# EAGLE design Noduino-iBaihe (EAGLE 6.6.0)
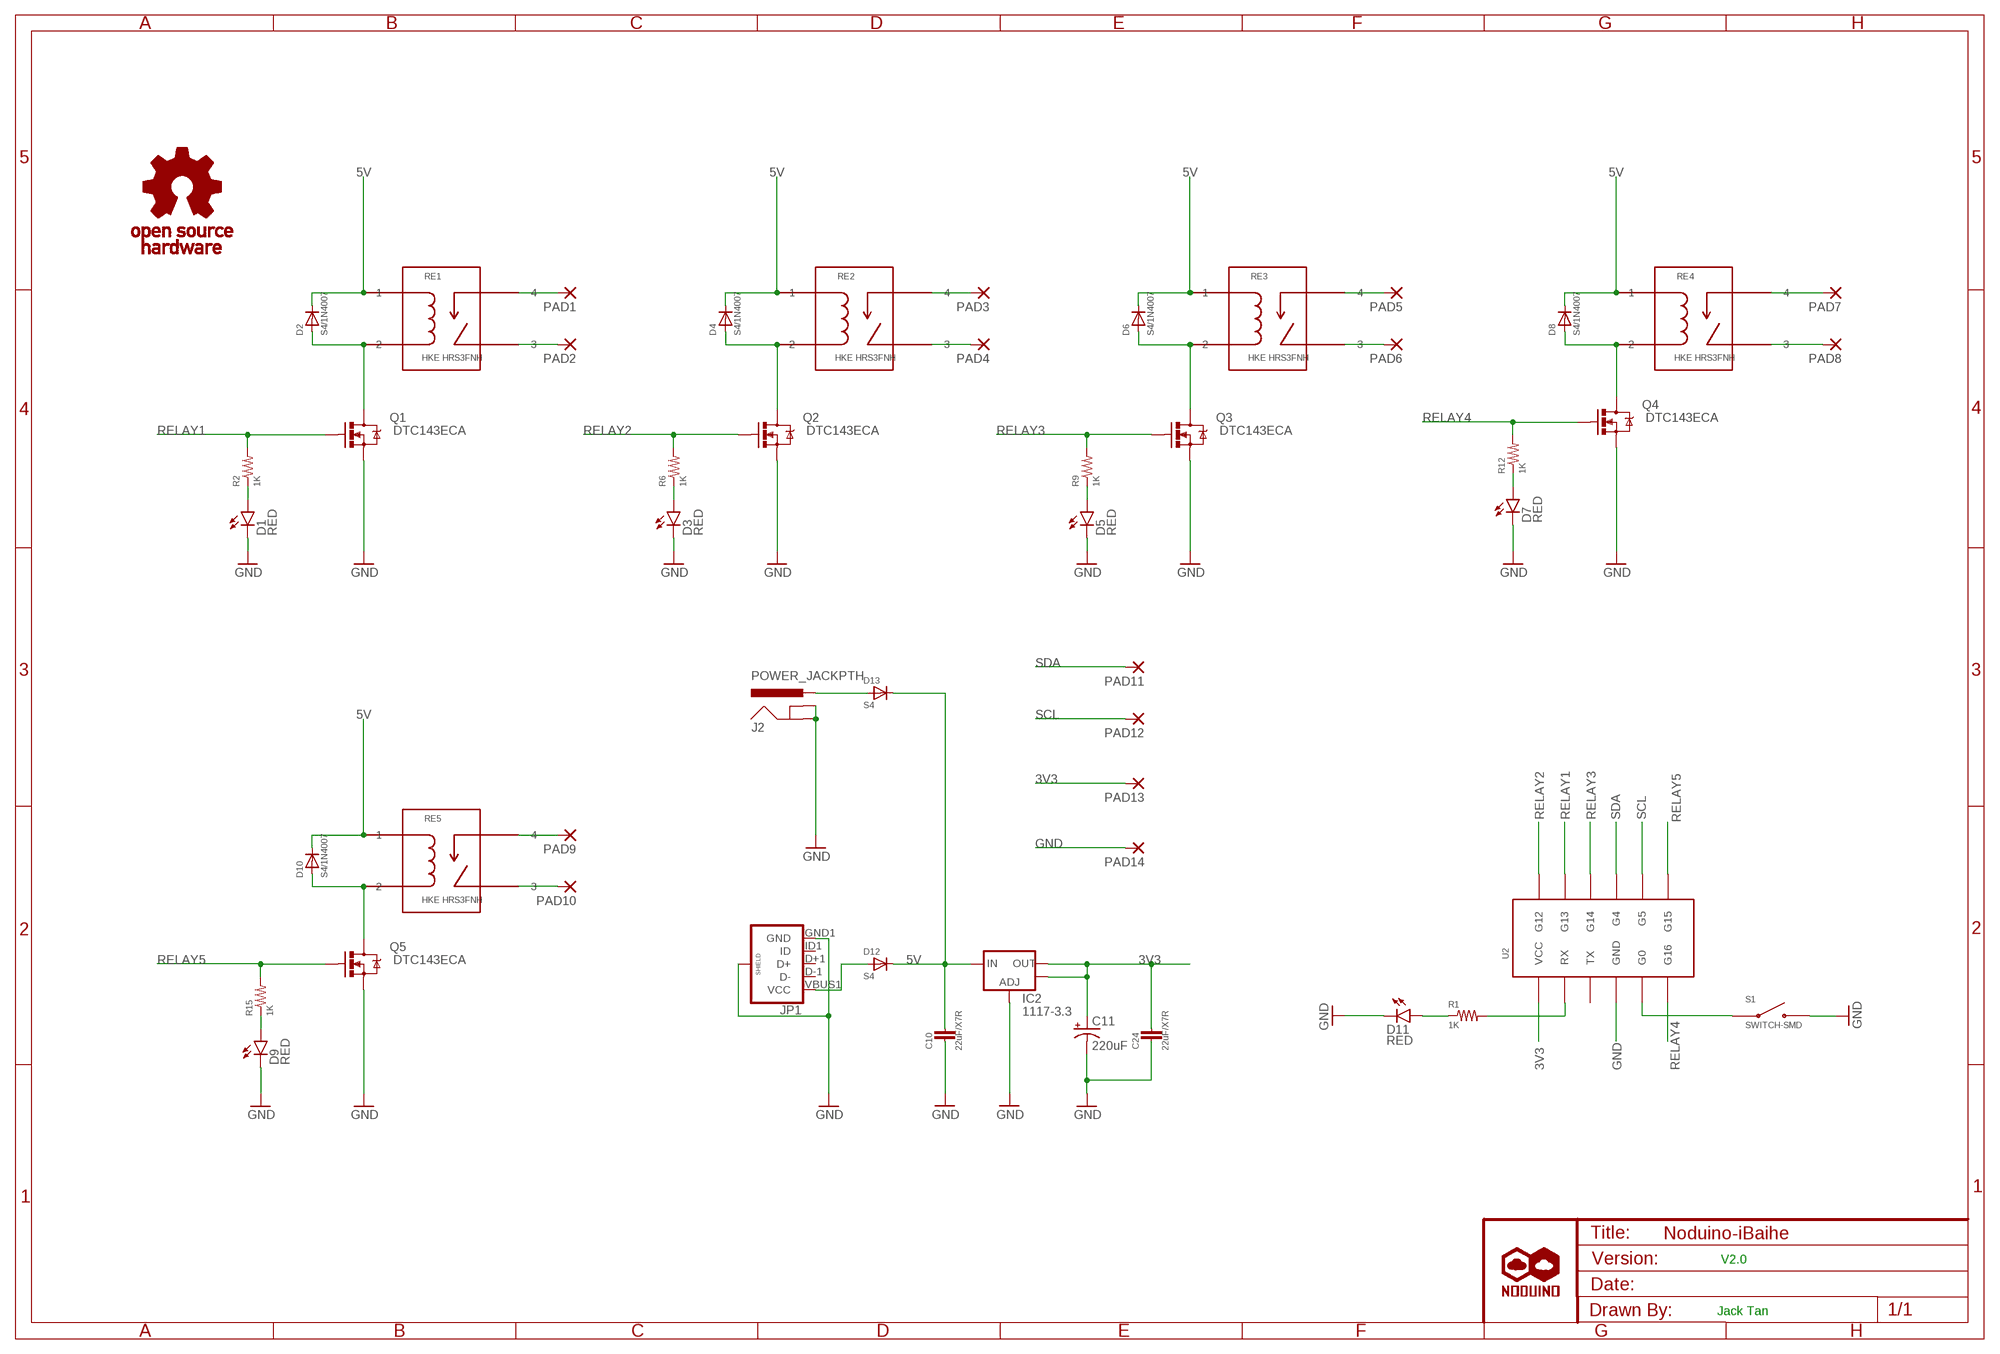
[diagram p0: schematic, sheet 1]

## Parts
C10  22uF/X7R  CAP-C1206  [C1206]
C11  220uF  CAP_POL3528  [EIA3528]
C24  22uF/X7R  CAP-C1206  [C1206]
D1  RED  LED-RED0603  [LED-0603]
D2  S4/1N4007  DIODESOD  [SOD-323]
D3  RED  LED-RED0603  [LED-0603]
D4  S4/1N4007  DIODESOD  [SOD-323]
D5  RED  LED-RED0603  [LED-0603]
D6  S4/1N4007  DIODESOD  [SOD-323]
D7  RED  LED-RED0603  [LED-0603]
D8  S4/1N4007  DIODESOD  [SOD-323]
D9  RED  LED-RED0603  [LED-0603]
D10  S4/1N4007  DIODESOD  [SOD-323]
D11  RED  LED-RED0603  [LED-0603]
D12  S4  DIODESOD  [SOD-323]
D13  S4  DIODESOD  [SOD-323]
IC2  1117-3.3  AMS1117SOT223  [SOT223]
J2  POWER_JACKPTH  [POWER_JACK_PTH]
JP1  USB_MICROB_PLUG  [MICROUSB-SMD-DIP]
PAD1  2,15/1,0  [2,15/1,0]
PAD2  2,15/1,0  [2,15/1,0]
PAD3  2,15/1,0  [2,15/1,0]
PAD4  2,15/1,0  [2,15/1,0]
PAD5  2,15/1,0  [2,15/1,0]
PAD6  2,15/1,0  [2,15/1,0]
PAD7  2,15/1,0  [2,15/1,0]
PAD8  2,15/1,0  [2,15/1,0]
PAD9  2,15/1,0  [2,15/1,0]
PAD10  2,15/1,0  [2,15/1,0]
PAD11  1PIN0.8DRILL  [0.8/1.6]
PAD12  1PIN0.8DRILL  [0.8/1.6]
PAD13  1PIN0.8DRILL  [0.8/1.6]
PAD14  1PIN0.8DRILL  [0.8/1.6]
Q1  DTC143ECA  MOSFET-N-SMD  [SOT23-3]
Q2  DTC143ECA  MOSFET-N-SMD  [SOT23-3]
Q3  DTC143ECA  MOSFET-N-SMD  [SOT23-3]
Q4  DTC143ECA  MOSFET-N-SMD  [SOT23-3]
Q5  DTC143ECA  MOSFET-N-SMD  [SOT23-3]
R1  1K  0603-RESISTOR  [0603-RES]
R2  1K  0603-RESISTOR  [0603-RES]
R6  1K  0603-RESISTOR  [0603-RES]
R9  1K  0603-RESISTOR  [0603-RES]
R12  1K  0603-RESISTOR  [0603-RES]
R15  1K  0603-RESISTOR  [0603-RES]
RE1  HKE HRS3FNH  HKE-HRS3FNH  [HKE-HRS3FN]
RE2  HKE HRS3FNH  HKE-HRS3FNH  [HKE-HRS3FN]
RE3  HKE HRS3FNH  HKE-HRS3FNH  [HKE-HRS3FN]
RE4  HKE HRS3FNH  HKE-HRS3FNH  [HKE-HRS3FN]
RE5  HKE HRS3FNH  HKE-HRS3FNH  [HKE-HRS3FN]
S1  SWITCH-SMD  [TACTILE-SWITCH-1101NE]
U2  MOD-SOCKET-V2.0  [MOD-PLUG-SOCKET-V2.0]
U$1  NODUINO-LOGO-ALL  [NODUINO-ALL-1]
U$2  OPEN_HARDWARE_LOGO  [OPEN_HARDWARE_LOGO]

## Nets
3V3: C11.A(+) C24.1 IC2.2(OUT) IC2.4(OUT) PAD13.1(P) U2.1(VCC)
5V: C10.1 D2.1(C) D4.1(C) D6.1(C) D8.1(C) D10.1(C) D12.1(C) D13.1(C) IC2.3(IN) RE1.1 RE2.1 RE3.1 RE4.1 RE5.1
GND: C10.2 C11.C(-) C24.2 D1.C D3.C D5.C D7.C D9.C D11.C IC2.1(ADJ) J2.GND J2.GNDBREAK JP1.GND1(GND) JP1.P$1(SHIELD) JP1.P$2(SHIELD) JP1.P$3(SHIELD) JP1.P$4(SHIELD) PAD14.1(P) Q1.2(S) Q2.2(S) Q3.2(S) Q4.2(S) Q5.2(S) S1.P$1 U2.4(GND)
N$1: D11.A R1.1
N$2: D2.2(A) Q1.3(D) RE1.2
N$3: PAD1.1(P) RE1.4
N$4: D1.A R2.1
N$5: PAD2.1(P) RE1.3
N$6: D12.2(A) JP1.VBUS1(VCC)
N$7: D3.A R6.1
N$8: D4.2(A) Q2.3(D) RE2.2
N$9: PAD3.1(P) RE2.4
N$10: PAD4.1(P) RE2.3
N$11: D13.2(A) J2.PWR
N$12: D5.A R9.1
N$13: D6.2(A) Q3.3(D) RE3.2
N$14: PAD5.1(P) RE3.4
N$15: PAD6.1(P) RE3.3
N$17: D7.A R12.1
N$18: D8.2(A) Q4.3(D) RE4.2
N$19: PAD7.1(P) RE4.4
N$20: PAD8.1(P) RE4.3
N$22: D9.A R15.1
N$23: D10.2(A) Q5.3(D) RE5.2
N$24: PAD9.1(P) RE5.4
N$25: PAD10.1(P) RE5.3
N$29: S1.P$2 U2.5(G0)
RELAY1: Q1.1(G) R2.2 U2.11(G13)
RELAY2: Q2.1(G) R6.2 U2.12(G12)
RELAY3: Q3.1(G) R9.2 U2.10(G14)
RELAY4: Q4.1(G) R12.2 U2.6(G16)
RELAY5: Q5.1(G) R15.2 U2.7(G15)
SCL: PAD12.1(P) U2.8(G5)
SDA: PAD11.1(P) U2.9(G4)
WIFI_ST: R1.2 U2.2(RX)
Unconnected: JP1.D+1(D+) JP1.D-1(D-) JP1.ID1(ID) U2.3(TX)

## Notes on the sheet
- V2.0
- Jack Tan

## Library data of the parts
C10 C24 = digital-toy:CAP: Capacitor Standard 0603 ceramic capacitor, and 0.1" leaded capacitor.
C11 = ehl:CAP_POL: Capacitor Polarized These are standard SMD and PTH capacitors. Normally 10uF, 47uF, and 100uF in electrolytic and tantalum varieties. Always verify the external diameter of the through hole cap, it varies with capacity, voltage, and manufacturer. The EIA devices should be standard.
D1 D3 D5 D7 D9 D11 = ehl:LED-RED: Assorted Red LEDs LilyPad 1206- DIO-09912 1206- DIO-00809 0603- DIO-00819; PROD_ID: DIO-00819
D2 D4 D6 D8 D10 D12 D13 = ehl:DIODE: Diode These are standard reverse protection diodes and small signal diodes. SMA package can handle up to about 1A. SOD-323 can handle about 200mA. What the SOD-323 package when ordering, there are some mfgs out there that are 5-pin packages.
IC2 = ehl:AMS1117: Voltage Regulator LM1117 Standard adjustable voltage regulator but in SMD form. Spark Fun Electronics SKU : COM-00595
J2 = ehl:POWER_JACK: Power Jack This is the standard 5.5mm barrel jack for power. The PTH is the most common, proven, reliable, footprint. All others are experimental. The Slot footprint only works if the mill layer is transmitted to the PCB fab house so be warned. Spark Fun Electronics SKU : PRT-00119. Mating wall wart : TOL-00298 (and others)
JP1 = ehl:USB_MICROB_PLUG: USB Micro-B connectors Some male, some female. Watch your step!
PAD1-PAD10 = ehl:2,15/1,0: THROUGH-HOLE PAD
PAD11-PAD14 = ehl:1PIN: THROUGH-HOLE PAD
Q1-Q5 = ehl:MOSFET-N
R1 R2 R6 R9 R12 R15 = ehl:0603-RESISTOR
RE1-RE5 = ehl:HKE-HRS3FNH
S1 = ehl:SWITCH-SMD
U2 = ehl:MOD-SOCKET-V2.0
U$1 = ehl:NODUINO-LOGO-ALL
U$2 = ehl:OPEN_HARDWARE_LOGO

## Board
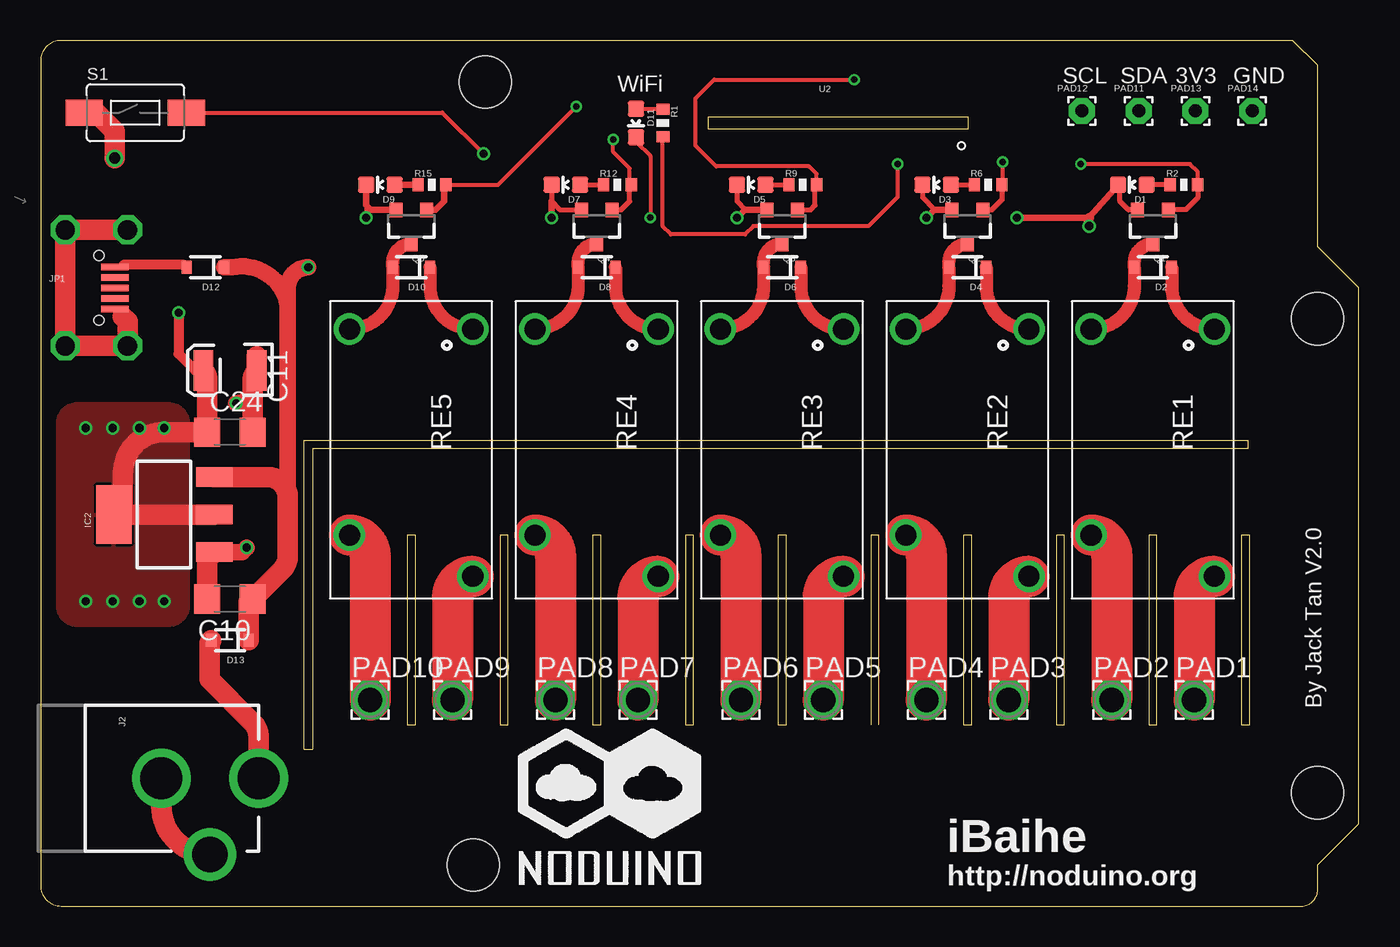
[diagram p1: board, top side]
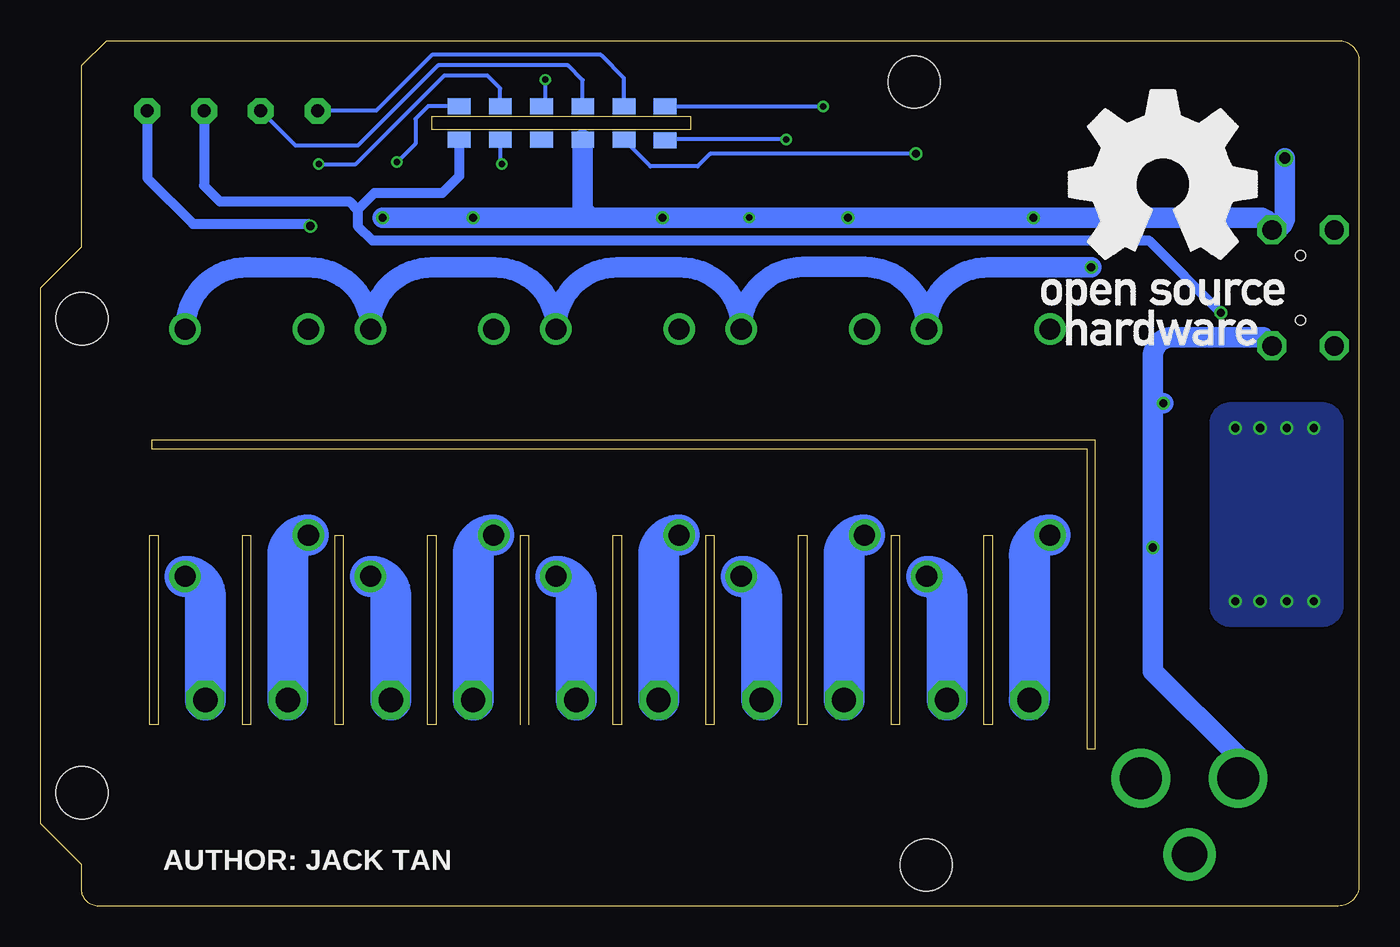
[diagram p2: board, bottom side, seen from below]

Size 81.28 x 53.34 mm. Coordinates in mm from the lower left corner, seen from the top.
Outline: 1.27,0 77.72,0 arc90 78.74,1.02 78.74,2.54 81.28,5.08 81.28,38.1 78.74,40.64 78.74,51.82 77.22,53.34 1.27,53.34 arc90 0,52.07 0,1.27 arc90 1.27,0
Copper layers (1*16): Top 0.035mm / dielectric 1.5mm / Bottom 0.035mm
Design rules "jackslab-micromod": minimum track width 6mil, minimum drill 0.3mm, track to track 6mil, track to pad 6mil, pad to pad 6mil, via to via 6mil, smd to smd 6mil, copper to edge 6mil, drill to drill 6mil, minimum pad ring 6mil, minimum via ring 6mil, stop-mask expansion 4mil, vias tented up to drill 20mil, thermal gap 6mil
Holes 3.2 mm at 78.74,6.99 78.74,36.2 27.43,50.8 26.67,2.54
Milling: 45 lines

### Footprints (pad centres in the part's own frame; a part is rotated, then mirrored left to right if it is on the bottom)
C1206 = smd 1.6 x 1.8: 1 -1.4,0; 2 1.4,0
EIA3528 = smd 1.2 x 2.5: A 1.65,0; C -1.65,0
LED-0603 = smd 1 x 1: A 0,-0.877; C 0,0.877
SOD-323 = smd 0.63 x 0.83: 1 -1.15,0; 2 1.15,0
SOT223 = smd 1.219 x 2.235: 1 -2.311,-3.099; 2 0,-3.099; 3 2.311,-3.099 | smd 3.6 x 2.2: 4 0,3.099
POWER_JACK_PTH = drill 2.6: GND 0,7.7; PWR 0,13.7 | drill 2.2: GNDBREAK 4.7,10.7
MICROUSB-SMD-DIP = smd 1.7 x 0.4: D+1 3.2,0; D-1 3.2,0.65; GND1 3.2,-1.3; ID1 3.2,-0.65; VBUS1 3.2,1.3 | drill 1.2 octagon: P$1 0.125,-3.575; P$2 0.125,3.575; P$3 3.975,-3.575; P$4 3.975,3.575 | hole 0.6: 2.2,2; 2.2,-2
2,15/1,0 = drill 1.5 pad 2.35 octagon: 1 0,0
0.8/1.6 = drill 0.8 pad 1.6 octagon: 1 0,0
SOT23-3 = smd 0.8 x 0.9: 1 -0.95,-1; 2 0.95,-1; 3 0,1.1
0603-RES = smd 0.7 x 0.8: 1 -0.85,0; 2 0.85,0
HKE-HRS3FN = drill 1.3: 1 0,7.6; 2 0,0; 3 12.7,0; 4 15.24,7.6
TACTILE-SWITCH-1101NE = smd 2.3 x 1.6: P$1 -3.15,0; P$2 3.15,0
MOD-PLUG-SOCKET-V2.0 = smd 1.4 x 1 bottom: 1 14.2,-1.04; 2 11.66,-1.04; 3 9.12,-1.04; 4 6.58,-1.04; 5 4.04,-1.04; 6 1.5,-1.06; 7 1.5,1.04; 8 4.04,1.04; 9 6.58,1.04; 10 9.12,1.04; 11 11.66,1.04; 12 14.2,1.04

### Placement (x,y rotation side)
C10  11.68,18.92 180 top
C11  11.68,33.02 180 top
C24  11.68,29.21 0 top
D1  67.31,44.45 90 top
D2  68.58,39.37 180 top
D3  55.24,44.45 90 top
D4  57.15,39.37 180 top
D5  43.81,44.45 90 top
D6  45.72,39.37 180 top
D7  32.38,44.45 90 top
D8  34.29,39.37 180 top
D9  20.95,44.45 90 top
D10  22.86,39.37 180 top
D11  36.71,48.26 180 top
D12  10.16,39.37 180 top
D13  11.68,16.38 180 top
IC2  7.62,24.13 90 top
J2  -0.25,7.87 270 top
JP1  1.4,38.1 0 top
PAD1  71.12,12.7 0 top
PAD2  66.04,12.7 0 top
PAD3  59.69,12.7 0 top
PAD4  54.61,12.7 0 top
PAD5  48.26,12.7 0 top
PAD6  43.18,12.7 0 top
PAD7  36.83,12.7 0 top
PAD8  31.75,12.7 0 top
PAD9  25.4,12.7 0 top
PAD10  20.32,12.7 0 top
PAD11  67.7,49 0 top
PAD12  64.2,49 0 top
PAD13  71.2,49 0 top
PAD14  74.7,49 0 top
Q1  68.58,41.91 180 top
Q2  57.15,41.91 180 top
Q3  45.72,41.91 180 top
Q4  34.29,41.91 180 top
Q5  22.86,41.91 180 top
R1  38.37,48.26 270 top
R2  70.48,44.45 0 top
R6  58.42,44.45 0 top
R9  46.99,44.45 0 top
R12  35.56,44.45 0 top
R15  24.13,44.45 0 top
RE1  64.77,35.56 270 top
RE2  53.34,35.56 270 top
RE3  41.91,35.56 270 top
RE4  30.48,35.56 270 top
RE5  19.05,35.56 270 top
S1  5.84,48.9 0 top
U2  41.27,48.26 0 top
U$1  29.08,0.64 0 top
U$2  19.58,34.56 0 bottom

### Tracks (layer width: path | path; a pad name or v marks a point on that pad's centre or on a via)
3V3  (via drill 0.5)
  Top 0.61: v8.51,36.58 8.51,34.04 9.53,33.02 C11.A
  Top 1.27: IC2.2 5.08,24.13 5.08,26.67 arc-90 7.62,29.21 C24.1 10.28,32.42 arc45 C11.A
  Bottom 0.61: U2.1 55.48,44.98 56.52,43.94 60.71,43.94 61.72,42.93 | 61.72,42.93 61.72,41.91 60.83,41.02 12.95,41.02 v8.51,36.58 | PAD13.1 71.2,44.4 70.23,43.43 62.23,43.43 61.72,42.93
  other vias: 2.79,29.46 4.45,29.46 6.1,29.46 7.62,29.46 2.79,18.8 4.45,18.8 6.1,18.8 7.62,18.8
  pour Bottom: 1.02,29.72 1.02,18.54 arc90 2.29,17.27 7.87,17.27 arc90 9.14,18.54 9.14,29.72 arc90 7.87,30.99 2.29,30.99 arc90
  pour Top: 9.14,29.72 9.14,18.54 arc-90 7.87,17.27 2.29,17.27 arc-90 1.02,18.54 1.02,29.72 arc-90 2.29,30.99 7.87,30.99 arc-90
5V  (via drill 0.5)
  Top 0.813: D10.1 24.01,38.2 arc90 RE5.1 | D2.1 69.73,38.2 arc90 RE1.1 | D8.1 35.44,38.2 arc90 RE4.1 | D6.1 46.87,38.2 arc90 RE3.1 | D4.1 58.3,38.2 arc90 RE2.1
  Top 1.016: D12.1 11.81,39.37 arc-90 15.24,37.08 | 15.24,37.08 15.24,25.15 15.24,23.75 | v16.51,39.37 arc90 15.24,38.1 15.24,37.08
  Top 1.27: D13.1 12.83,18.67 arc-90 C10.1 14.87,20.71 arc45 15.24,21.61 15.24,25.15 15.24,25.17 arc90 13.97,26.44 IC2.3
  Bottom 1.27: RE1.1 arc90 68.56,39.37 64.75,39.37 arc90 RE2.1 arc90 57.13,39.37 53.32,39.37 arc90 RE3.1 arc90 45.7,39.37 41.89,39.37 arc90 RE4.1 arc90 34.25,39.39 30.48,39.39 arc90 RE5.1 | 26.65,35.64 RE5.1 | v16.51,39.37 22.84,39.37 arc-90 RE5.1
GND  (via drill 0.4, 0.5, 0.7)
  Top 0.254: D9.C 20.08,42.43 v20.07,42.42 | 60.33,42.55 v60.2,42.42 | 5.08,36.32 JP1.GND1 | D11.C 36.71,47.11 37.59,46.23 v37.59,42.42
  Top 0.305: Q1.2 67.07,42.91 66.55,43.43 66.55,44.34 D1.C | D3.C 54.37,43.68 55.12,42.93 56.18,42.93 Q2.2 | D7.C 31.51,43.42 32,42.93 33.32,42.93 Q4.2 | D5.C 42.94,43.42 43.43,42.93 44.75,42.93 Q3.2
  Top 0.406: Q5.2 20.34,42.91 20.07,43.18 20.07,44.44 D9.C | v60.2,42.42 64.64,42.41 D1.C | Q2.2 55.1,42.91 v54.61,42.42 | Q3.2 43.41,42.91 v42.93,42.42 | 31.51,43.42 31.51,42.43 v31.5,42.42
  Top 0.61: v64.64,41.91 64.64,42.41
  Top 1.016: IC2.1 12.42,21.82 v12.7,22.1 | v12.06,30.99 arc90 13.08,32.01 13.08,32.42
  Top 1.27: v4.57,46.1 4.57,47.75 3.3,49.02 2.82,49.02 S1.P$1 | 10.39,21.82 IC2.1 10.28,21.38 C10.2 | J2.GNDBREAK arc-90 7.45,6.17 J2.GND | JP1.P$4 JP1.P$2 JP1.P$1 JP1.P$3 5.37,36.03 5.08,36.32 | 13.33,33.89 C11.C arc45 13.08,32.42 C24.2
  Bottom 0.61: PAD14.1 74.7,44.85 71.88,42.04 64.77,42.04 v64.64,41.91
  Bottom 1.016: 11.56,35.05
  Bottom 1.27: 47.37,42.42 v42.93,42.42 v37.59,42.42 v31.5,42.42 v20.07,42.42 6.15,42.42 arc88 JP1.P$4 arc-90 4.57,42.48 v4.57,46.1 | 47.37,42.42 v54.61,42.42 59.31,42.42 v60.2,42.42 | U2.4 47.85,42.91 47.37,42.42 | JP1.P$3 5.9,35.05 11.56,35.05 arc-90 12.7,33.91 12.7,31.62 | J2.GND 7.45,9.22 12.7,14.48 v12.7,22.1 12.7,31.62 | 12.7,31.62 arc-90 v12.06,30.99
N$1
  Top 0.254: R1.1 36.74,49.11 D11.A
N$2
  Top 0.813: RE1.2 arc90 67.43,38.22 D2.2 67.43,39.66 arc-90 Q1.3
N$3
  Top 2.54: 72.39,20.32 arc90 71.12,19.05 PAD1.1
  Bottom 2.54: RE1.4 arc90 71.12,19.07 PAD1.1
N$4
  Top 0.305: R2.1 D1.A
N$5
  Top 2.54: RE1.3 arc-90 66.04,21.59 PAD2.1
  Bottom 2.54: RE1.3 arc-90 66.04,21.59 PAD2.1
N$6
  Top 0.406: 5.11,39.52 4.98,39.4 JP1.VBUS1
  Top 0.61: D12.2 8.86,39.52 5.11,39.52
N$7
  Top 0.305: D3.A R6.1
N$8
  Top 0.813: RE2.2 arc90 56,38.22 D4.2 56,39.66 arc-90 Q2.3
N$9
  Top 2.54: 60.96,20.32 arc90 59.69,19.05 PAD3.1
  Bottom 2.54: RE2.4 arc90 59.69,19.07 PAD3.1
N$10
  Top 2.54: RE2.3 arc-90 54.61,21.59 PAD4.1
  Bottom 2.54: RE2.3 arc-90 54.61,21.59 PAD4.1
N$11
  Top 1.27: J2.PWR 13.45,10.41 arc45 13.07,11.31 10.41,13.97 10.41,16.09 arc-45 D13.2
N$12
  Top 0.305: D5.A R9.1
N$13
  Top 0.813: RE3.2 arc90 44.57,38.22 D6.2 44.57,39.66 arc-90 Q3.3
N$14
  Top 2.54: 49.53,20.32 arc90 48.26,19.05 PAD5.1
  Bottom 2.54: RE3.4 arc90 48.26,19.07 PAD5.1
N$15
  Top 2.54: RE3.3 arc-90 43.18,21.59 PAD6.1
  Bottom 2.54: RE3.3 arc-90 43.18,21.59 PAD6.1
N$17
  Top 0.305: D7.A R12.1
N$18
  Top 0.813: RE4.2 arc90 33.14,38.22 D8.2 33.14,39.66 arc-90 Q4.3
N$19
  Top 2.54: 38.1,20.32 arc90 36.83,19.05 PAD7.1
  Bottom 2.54: RE4.4 arc90 36.83,19.07 PAD7.1
N$20
  Top 2.54: RE4.3 arc-90 31.75,21.59 PAD8.1
  Bottom 2.54: RE4.3 arc-90 31.75,21.59 PAD8.1
N$22
  Top 0.406: D9.A R15.1
N$23
  Top 0.813: RE5.2 arc90 21.71,38.22 D10.2 21.71,39.66 arc-90 Q5.3
N$24
  Top 2.54: 26.67,20.32 arc90 25.4,19.05 PAD9.1
  Bottom 2.54: RE5.4 arc90 25.4,19.07 PAD9.1
N$25
  Top 2.54: RE5.3 arc-90 20.32,21.59 PAD10.1
  Bottom 2.54: RE5.3 arc-90 20.32,21.59 PAD10.1
N$29  (via drill 0.5)
  Top 0.254: S1.P$2 24.77,48.9 v27.3,46.35
  Bottom 0.254: v27.3,46.35 40.01,46.35 40.77,45.59 43.69,45.59 U2.5
RELAY1  (via drill 0.4)
  Top 0.254: R2.2 71.33,45.25 70.87,45.72 v64.14,45.72
  Top 0.305: R2.2 71.33,43.65 70.61,42.93 69.55,42.93 Q1.1
  Bottom 0.254: U2.11 52.94,50.4 53.72,51.18 56.39,51.18 61.85,45.72 v64.14,45.72
RELAY2  (via drill 0.4)
  Top 0.254: v59.31,45.85 59.31,44.49 R6.2
  Top 0.305: R6.2 59.27,43.52 58.66,42.91 Q2.1
  Bottom 0.254: U2.12 57.38,49.3 58.17,48.51 58.17,46.99 v59.31,45.85
RELAY3  (via drill 0.4)
  Top 0.254: R9.2 47.84,45.12 47.37,45.59 41.66,45.59 40.39,46.86 40.39,49.78 41.53,50.93 v50.16,50.93
  Top 0.305: Q3.1 47.48,42.91 47.75,43.18 47.75,44.36 R9.2
  Bottom 0.254: v50.16,50.93 50.16,49.53 U2.10
RELAY4  (via drill 0.4)
  Top 0.254: 36.32,44.36 36.32,45.47 35.31,46.48 v35.31,47.24
  Top 0.305: Q4.1 35.8,42.91 36.32,43.43 36.32,44.36 R12.2
  Bottom 0.254: v35.31,47.24 42.73,47.24 U2.6
RELAY5  (via drill 0.4)
  Top 0.254: R15.2 28.19,44.45 v33.02,49.28
  Top 0.406: Q5.1 24.37,42.91 24.89,43.43 24.89,44.36 R15.2
  Bottom 0.254: v33.02,49.28 42.75,49.28 U2.7
SCL
  Bottom 0.254: U2.8 45.31,51.03 46.74,52.45 57.15,52.45 60.58,49.02 64.18,49.02 PAD12.1
SDA
  Bottom 0.254: U2.9 47.85,50.9 48.77,51.82 56.77,51.82 61.72,46.86 65.56,46.86 PAD11.1
WIFI_ST  (via drill 0.4)
  Top 0.254: v52.83,45.72 52.83,43.69 51.05,41.91 43.94,41.91 43.43,41.4 38.86,41.4 38.35,41.91 38.35,47.27 R1.2
  Bottom 0.254: U2.2 52.94,45.82 v52.83,45.72

### Text on the board
tPlace: SCL | SDA | 3V3 | GND | WiFi | By Jack Tan V2.0 | iBaihe | http://noduino.org
bPlace: AUTHOR: JACK TAN